# EAGLE schematic LED array - interface v1.3 (EAGLE 6.5.0)
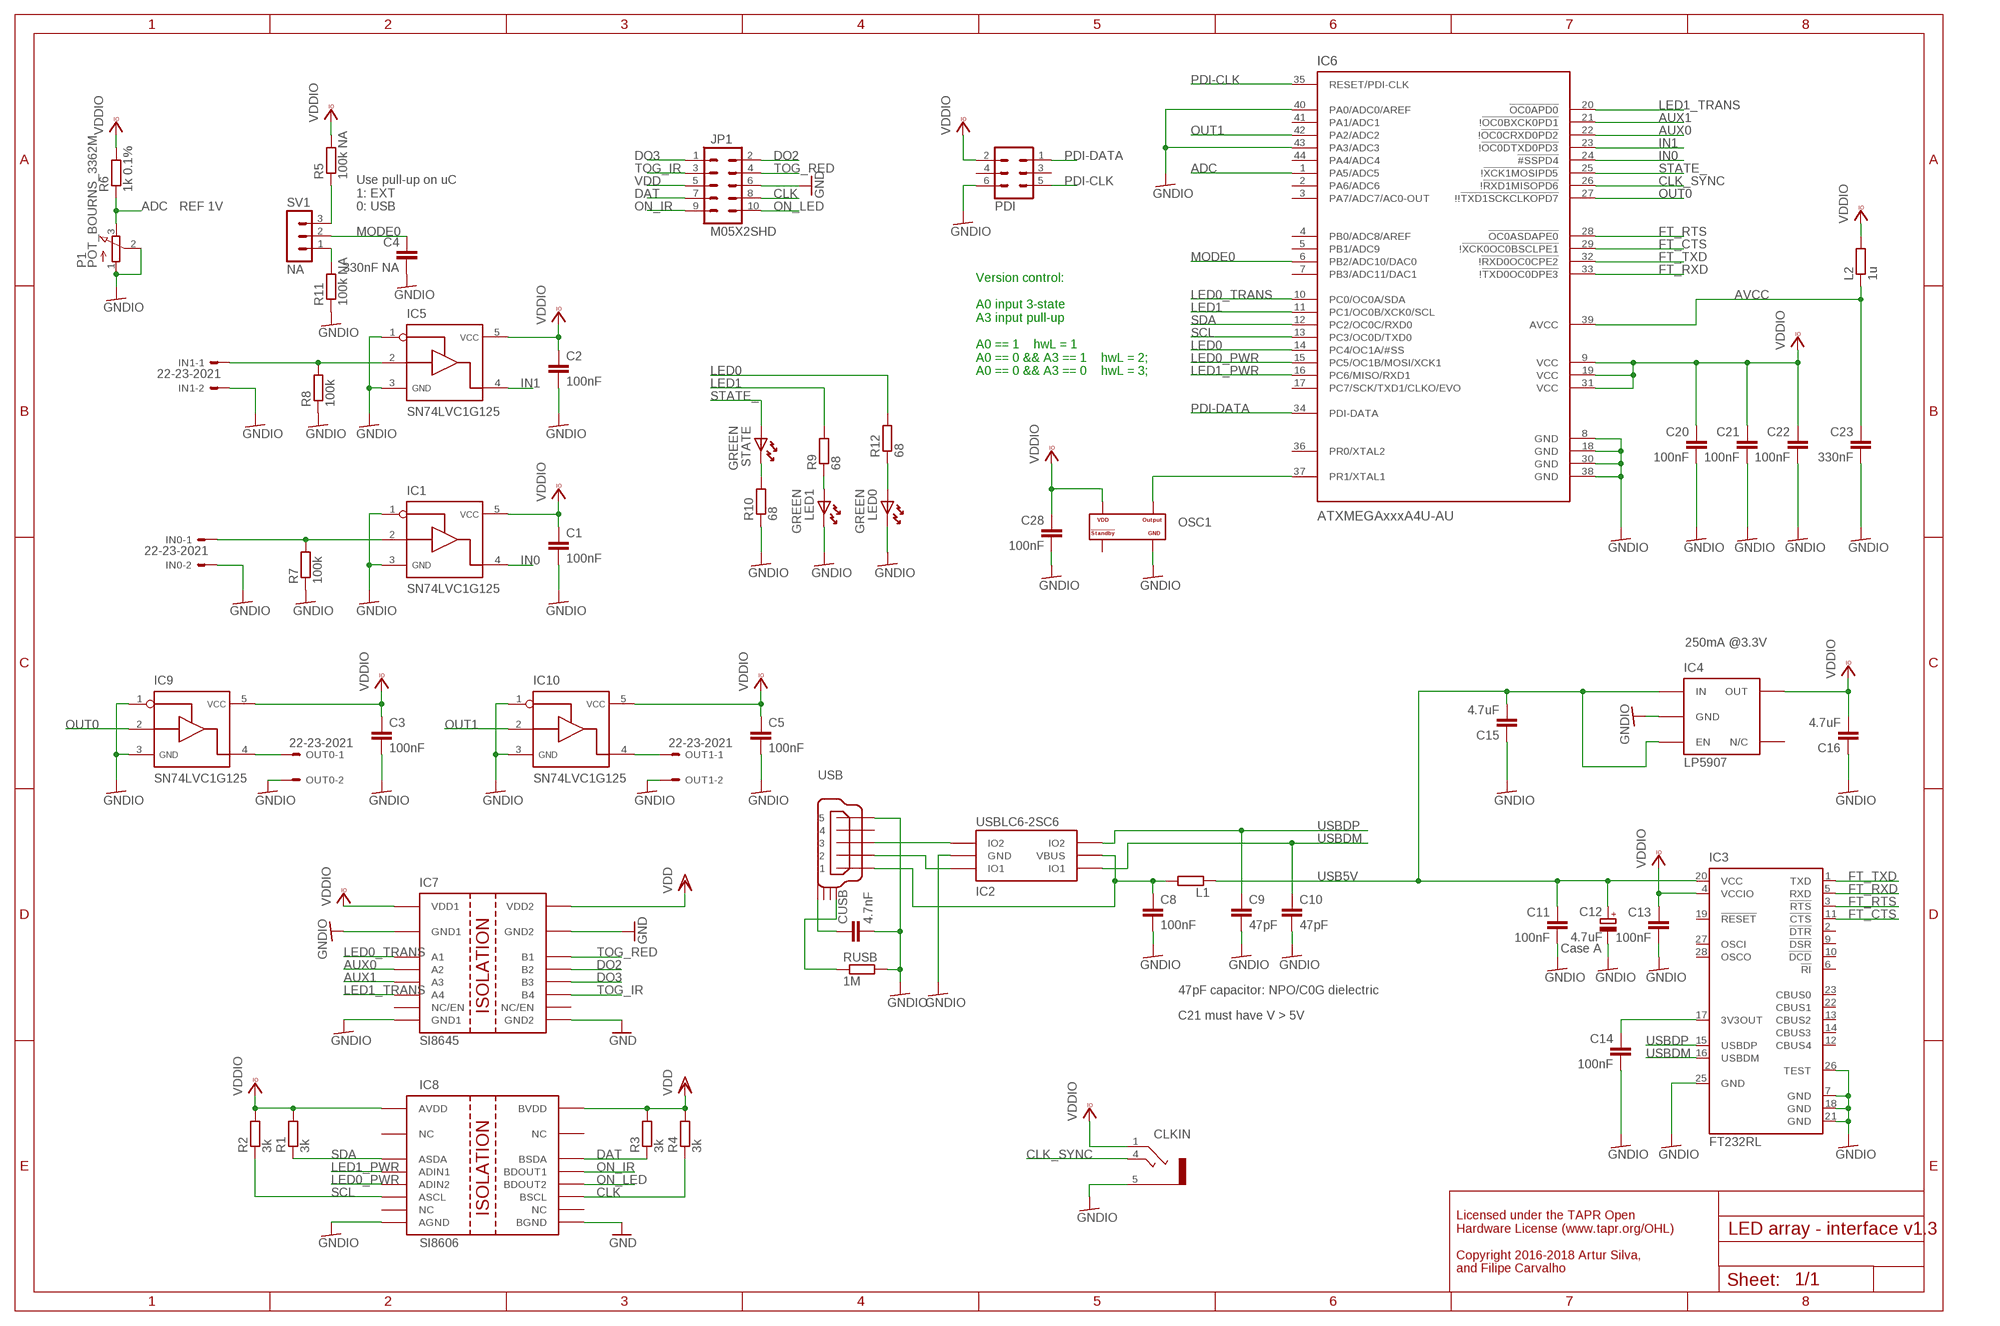
[diagram p0: schematic, sheet 1]

## Parts
C1  100nF  C-EUC0402  [C0402]
C2  100nF  C-EUC0402  [C0402]
C3  100nF  C-EUC0402  [C0402]
C4  330nF NA  C-EUC0402  [C0402]
C5  100nF  C-EUC0402  [C0402]
C8  100nF  C-EUC0402  [C0402]
C9  47pF  C-EUC0402  [C0402]
C10  47pF  C-EUC0402  [C0402]
C11  100nF  C-EUC0402  [C0402]
C12  4.7uF  CPOL-EUA/3216-18W  [A/3216-18W]
C13  100nF  C-EUC0402  [C0402]
C14  100nF  C-EUC0402  [C0402]
C15  4.7uF  C-EUC0402  [C0402]
C16  4.7uF  C-EUC0402  [C0402]
C20  100nF  C-EUC0402  [C0402]
C21  100nF  C-EUC0402  [C0402]
C22  100nF  C-EUC0402  [C0402]
C23  330nF  C-EUC0402  [C0402]
C28  100nF  C-EUC0402  [C0402]
CLKIN  STEREO_JACK  [35RASMT2BHNTRX]
CUSB  4.7nF  C-EUC0402  [C0402]
IC1  SN74LVC1G125  [SOT23-5]
IC2  USBLC6-2SC6  USBLC6-2  [SOT23-6L]
IC3  FT232RL  [SSOP28]
IC4  LP5907  TLV700XX  [TSOT23-5]
IC5  SN74LVC1G125  [SOT23-5]
IC6  ATXMEGAxxxA4U-AU  AT-XMEGA-XXA4-AU  [QFP80P1200X1200X120-44N]
IC7  SI8645  [NSOIC-16]
IC8  SI8606  [NSOIC-16]
IC9  SN74LVC1G125  [SOT23-5]
IC10  SN74LVC1G125  [SOT23-5]
IN0  22-23-2021  [22-23-2021]
IN1  22-23-2021  [22-23-2021]
JP1  M05X2SHD  [2X5-SHROUDED]
L1  ???  R-EU_R0805  [R0805]
L2  1u  R-EU_R0805  [R0805]
LED0  GREEN  LEDHAND  [LED_HAND]
LED1  GREEN  LEDHAND  [LED_HAND]
OSC1  OSCILLATOR  [OSCILLATOR_3.2X2.5]
OUT0  22-23-2021  [22-23-2021]
OUT1  22-23-2021  [22-23-2021]
P1  POT_BOURNS_3362M  [POT_BOURNS_3362M]
PDI  MA03-2  [MA03-2]
R1  3k  R-EU_R0402  [R0402]
R2  3k  R-EU_R0402  [R0402]
R3  3k  R-EU_R0402  [R0402]
R4  3k  R-EU_R0402  [R0402]
R5  100k NA  R-EU_R0402  [R0402]
R6  1k 0.1%  R-EU_R0402  [R0402]
R7  100k  R-EU_R0402  [R0402]
R8  100k  R-EU_R0402  [R0402]
R9  68  R-EU_R0402  [R0402]
R10  68  R-EU_R0402  [R0402]
R11  100k NA  R-EU_R0402  [R0402]
R12  68  R-EU_R0402  [R0402]
RUSB  1M  R-EU_R0603  [R0603]
STATE  GREEN  LEDHAND  [LED_HAND]
SV1  NA  MA03-1  [MA03-1]
USB  USB_MINI_B  [240-0002-1]

## Nets
ADC: IC6.1(PA5/ADC5) P1.3(E) R6.1
ADC1: R5.1 SV1.3
AUX0: IC6.22(!!OC0CRXD0PD2) IC7.4(A2)
AUX1: IC6.21(!!OC0BXCK0PD1) IC7.5(A3)
AVCC: C23.1 IC6.39(AVCC) L2.1
CLK: IC8.11(BSCL) JP1.8 R4.1
CLK_SYNC: CLKIN.4 IC6.26(!!RXD1MISOPD6)
DAT: IC8.14(BSDA) JP1.7 R3.1
DO2: IC7.13(B2) JP1.2
DO3: IC7.12(B3) JP1.1
FT_CTS: IC3.11(!CTS) IC6.29(!!XCK0OC0BSCLPE1)
FT_RTS: IC3.3(!RTS) IC6.28(!OC0ASDAPE0)
FT_RXD: IC3.5(RXD) IC6.33(!!TXD0OC0DPE3)
FT_TXD: IC3.1(TXD) IC6.32(!!RXD0OC0CPE2)
GND: IC7.9(GND2) IC7.15(GND2) IC8.9(BGND) JP1.6
GND2: IC5.2 IN1.1 R8.2
GNDIO: C1.2 C2.2 C3.2 C4.2 C5.2 C8.2 C9.2 C10.2 C11.2 C12.- C13.2 C14.2 C15.1 C16.1 C20.2 C21.2 C22.2 C23.2 C28.2 CLKIN.5 CUSB.2 IC1.1 IC1.3 IC2.P$2(GND) IC3.7(GND) IC3.18(GND) IC3.21(GND) IC3.25(GND) IC3.26(TEST) IC4.2(GND) IC5.1 IC5.3 IC6.8(GND) IC6.18(GND) IC6.30(GND) IC6.38(GND) IC6.40(PA0/ADC0/AREF) IC6.43(PA3/ADC3) IC7.2(GND1) IC7.8(GND1) IC8.8(AGND) IC9.1 IC9.3 IC10.1 IC10.3 IN0.2 IN1.2 LED0.K LED1.K OSC1.P$2(GND) OUT0.2 OUT1.2 P1.1(A) P1.2(S) PDI.6 R7.1 R8.1 R10.1 R11.1 RUSB.2 USB.P$5
IN0: IC1.4 IC6.24(!#SSPD4)
IN1: IC5.4 IC6.23(!!OC0DTXD0PD3)
LED0: IC6.14(PC4/OC1A/#SS) R12.2
LED0_PWR: IC6.15(PC5/OC1B/MOSI/XCK1) IC8.5(ADIN2)
LED0_TRANS: IC6.10(PC0/OC0A/SDA) IC7.3(A1)
LED1: IC6.11(PC1/OC0B/XCK0/SCL) R9.2
LED1_PWR: IC6.16(PC6/MISO/RXD1) IC8.4(ADIN1)
LED1_TRANS: IC6.20(!OC0APD0) IC7.6(A4)
MODE0: C4.1 IC6.6(PB2/ADC10/DAC0) SV1.2
N$1: R11.2 SV1.1
N$2: C14.1 IC3.17(3V3OUT)
N$3: IC9.4 OUT0.1
N$4: IC2.P$3(IO2) USB.P$3
N$6: LED0.A R12.1
N$7: IC10.4 OUT1.1
N$8: R10.2 STATE.K
N$9: IC1.2 IN0.1 R7.2
N$24: LED1.A R9.1
N$39: C8.1 IC2.P$5(VBUS) L1.2 USB.P$1
N$40: IC2.P$1(IO1) USB.P$2
N$59: CUSB.1 USB.SHIELD_4
N$61: RUSB.1 USB.SHIELD_1
ON_IR: IC8.13(BDOUT1) JP1.9
ON_LED: IC8.12(BDOUT2) JP1.10
OSC1: IC6.37(PR1/XTAL1) OSC1.P$3(OUTPUT)
OUT0: IC6.27(!!!TXD1SCKCLKOPD7) IC9.2
OUT1: IC6.42(PA2/ADC2) IC10.2
PDI-CLK: IC6.35(RESET/PDI-CLK) PDI.5
PDI-DATA: IC6.34(PDI-DATA) PDI.1
SCL: IC6.13(PC3/OC0D/TXD0) IC8.6(ASCL) R2.1
SDA: IC6.12(PC2/OC0C/RXD0) IC8.3(ASDA) R1.1
STATE_: IC6.25(!!XCK1MOSIPD5) STATE.A
TOG_IR: IC7.11(B4) JP1.3
TOG_RED: IC7.14(B1) JP1.4
USB5V: C11.1 C12.+ C15.2 IC3.20(VCC) IC4.1(IN) IC4.3(EN) L1.1
USBDM: C10.1 IC2.P$6(IO1) IC3.16(USBDM)
USBDP: C9.1 IC2.P$4(IO2) IC3.15(USBDP)
VCCIO: C1.1 C2.1 C3.1 C5.1 C13.1 C16.2 C20.1 C21.1 C22.1 C28.1 CLKIN.1 IC1.5 IC3.4(VCCIO) IC4.5(OUT) IC5.5 IC6.9(VCC) IC6.19(VCC) IC6.31(VCC) IC7.1(VDD1) IC8.1(AVDD) IC9.5 IC10.5 L2.2 OSC1.P$4(VDD) PDI.2 R1.2 R2.2 R5.2 R6.2 ; supply symbol labelled VDDIO
VDD: IC7.16(VDD2) IC8.16(BVDD) JP1.5 R3.2 R4.2
Unconnected: IC3.2(!DTR) IC3.6(!RI) IC3.9(!DSR) IC3.10(!DCD) IC3.12(CBUS4) IC3.13(CBUS2) IC3.14(CBUS3) IC3.19(!RESET) IC3.22(CBUS1) IC3.23(CBUS0) IC3.27(OSCI) IC3.28(OSCO) IC4.4(N/C) IC6.2(PA6/ADC6) IC6.3(PA7/ADC7/AC0-OUT) IC6.4(PB0/ADC8/AREF) IC6.5(PB1/ADC9) IC6.7(PB3/ADC11/DAC1) IC6.17(PC7/SCK/TXD1/CLKO/EVO) IC6.36(PR0/XTAL2) IC6.41(PA1/ADC1) IC6.44(PA4/ADC4) IC7.7(NC/EN) IC7.10(NC/EN) IC8.2(NC) IC8.7(NC) IC8.10(NC) IC8.15(NC) OSC1.P$1(STANDBY#) PDI.3 PDI.4 USB.P$4 USB.SHIELD_2 USB.SHIELD_3

## Notes on the sheet
- REF 1V
- Use pull-up on uC
  1: EXT
  0: USB
- Version control:
  
  A0 input 3-state
  A3 input pull-up
  
  A0 == 1    hwL = 1
  A0 == 0 && A3 == 1    hwL = 2;
  A0 == 0 && A3 == 0    hwL = 3;
- 250mA @3.3V
- Case A
- 47pF capacitor: NPO/C0G dielectric
- C21 must have V > 5V
- Licensed under the TAPR Open
  Hardware License (www.tapr.org/OHL)
  
  Copyright 2016-2018 Artur Silva, 
  and Filipe Carvalho

## Library data of the parts
C1-C5 C8-C11 C13-C16 C20-C23 C28 CUSB = rcl:C-EU: CAPACITOR, European symbol
C12 = rcl:CPOL-EU: POLARIZED CAPACITOR, European symbol
CLKIN = CNP-connectors:STEREO_JACK
IC1 IC5 IC9 IC10 = My_library 0v2:SN74LVC1G125
IC2 = CNP 2:USBLC6-2
IC3 = ftdichip:FT232R: Source: http://www.ftdichip.com/Documents/DataSheets/DS_FT232R_v104.pdf; MPN: FT232RL; OC_FARNELL: 1146032; OC_NEWARK: 91K9918
IC4 = CNP-ics 2:TLV700XX
IC6 = xmega-a4:AT-XMEGA-XXA4-AU: ATxMega a4 Serie
IC7 = CNP-ics 2:SI8645
IC8 = CNP-ics 2:SI8606
IN0 IN1 OUT0 OUT1 = con-molex:22-23-2021: .100" (2.54mm) Center Header - 2 Pin; MF: MOLEX; MPN: 22-23-2021; OC_FARNELL: 1462926; OC_NEWARK: 25C3832
JP1 = SparkFun-Connectors:M05X2: Header 5x2 Standard 10-pin dual row 0.1" header. Commonly used with AVR-ISP. Use with Spark Fun Electronics SKU: PRT-00778
L1 L2 R1-R12 RUSB = rcl:R-EU_: RESISTOR, European symbol
LED0 LED1 STATE = CNP-miscellaneous:LED
OSC1 = CNP-miscellaneous:OSCILLATOR
P1 = CNP-miscellaneous:POT_BOURNS_3362M
PDI = con-lstb:MA03-2: PIN HEADER; OC_FARNELL: unknown; OC_NEWARK: unknown
SV1 = con-lstb:MA03-1: PIN HEADER; OC_FARNELL: unknown; OC_NEWARK: unknown
USB = CNP-connectors:USB_MINI_B